# EAGLE design boilerroom (EAGLE 6.6.0)
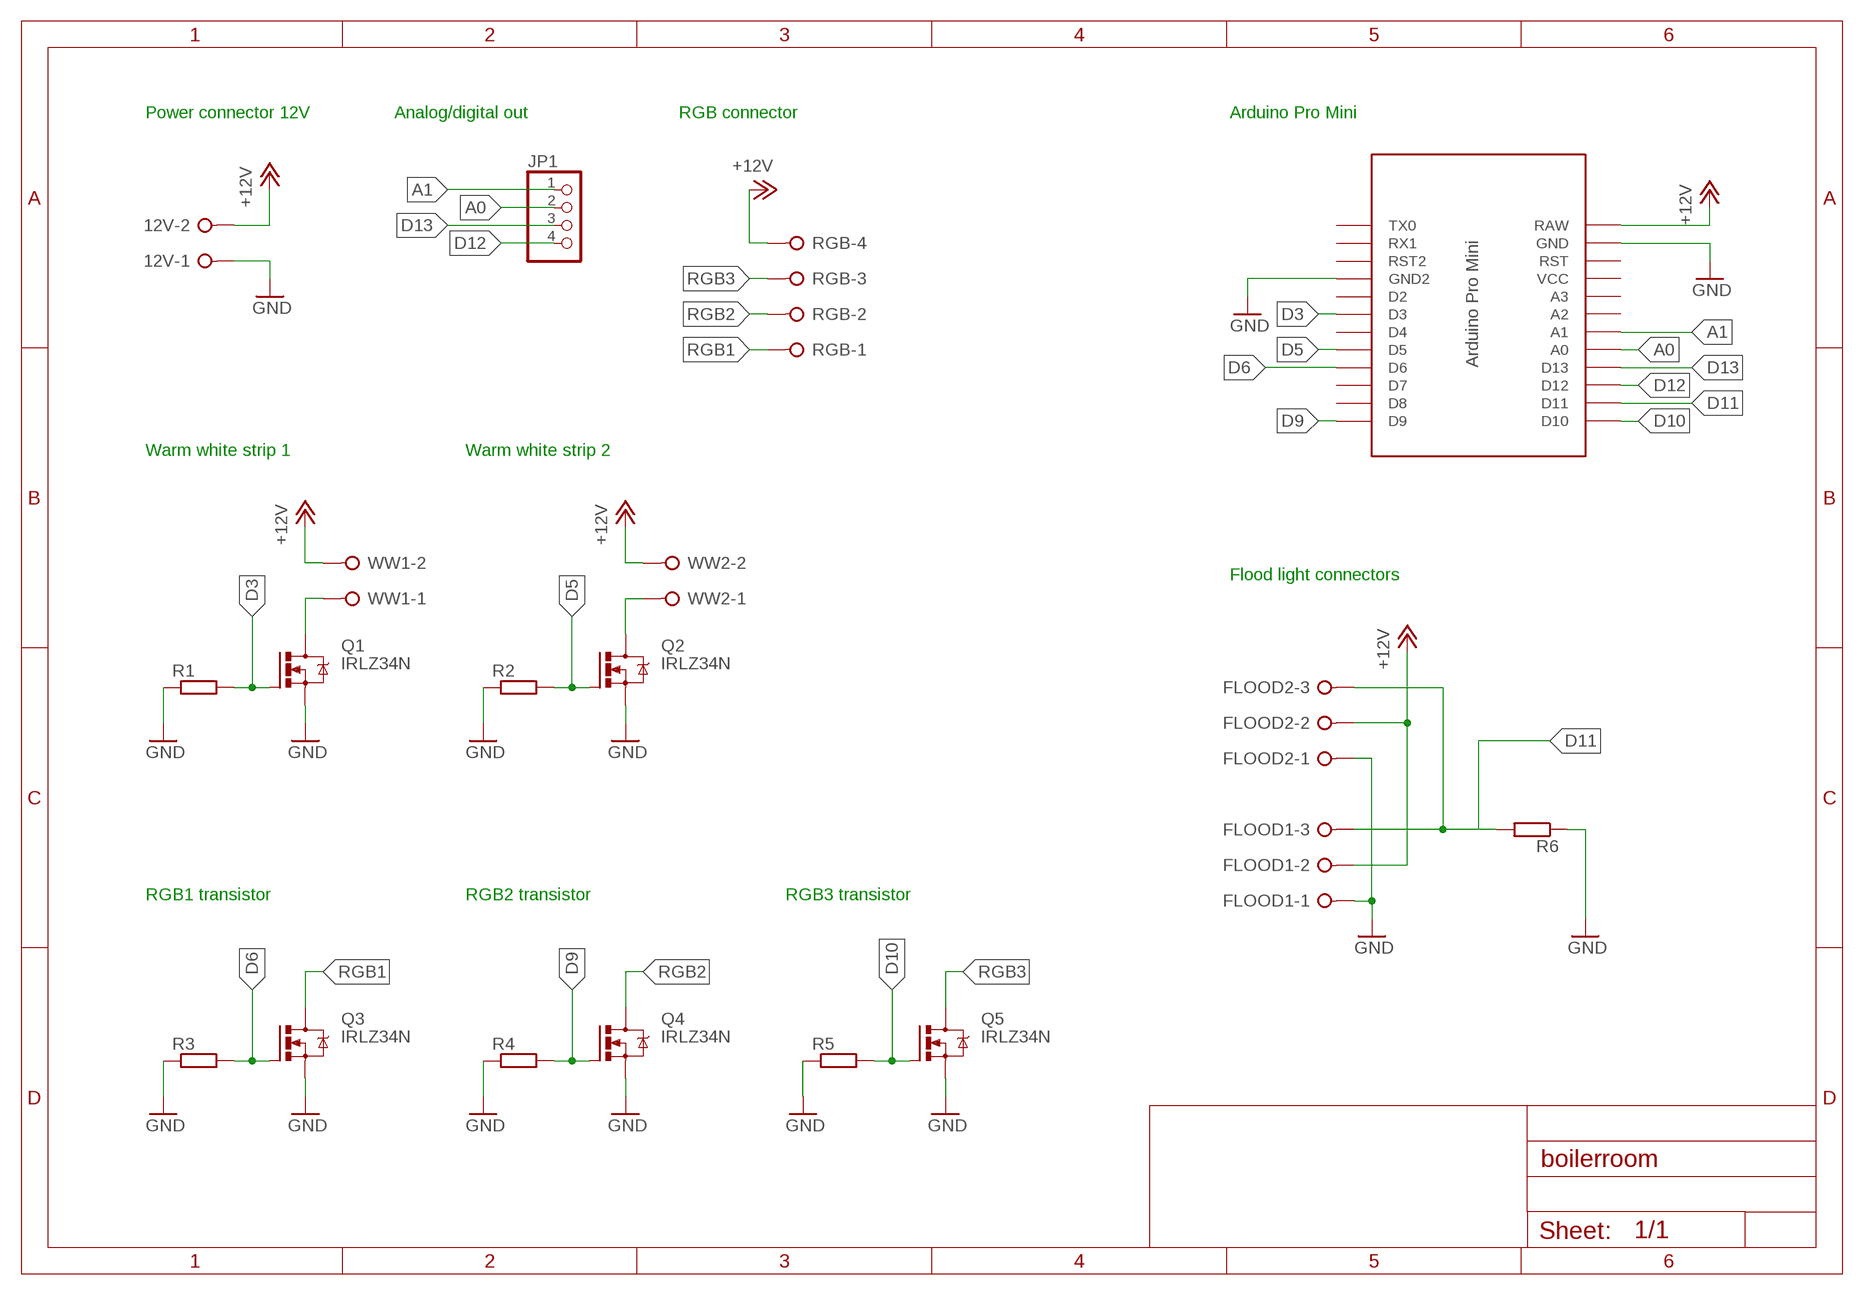
[diagram p0: schematic, sheet 1]

## Parts
12V  W237-02P  [W237-132]
FLOOD1  W237-03P  [W237-133]
FLOOD2  W237-03P  [W237-133]
JP1  PINHD-1X4  [1X04]
Q1  IRLZ34N  IRLZ44ZTO220BV  [TO220BV]
Q2  IRLZ34N  IRLZ44ZTO220BV  [TO220BV]
Q3  IRLZ34N  IRLZ44ZTO220BV  [TO220BV]
Q4  IRLZ34N  IRLZ44ZTO220BV  [TO220BV]
Q5  IRLZ34N  IRLZ44ZTO220BV  [TO220BV]
R1  R-EU_0207/10  [0207/10]
R2  R-EU_0207/10  [0207/10]
R3  R-EU_0207/10  [0207/10]
R4  R-EU_0207/10  [0207/10]
R5  R-EU_0207/10  [0207/10]
R6  R-EU_0207/10  [0207/10]
RGB  W237-04P  [W237-4P]
U$2  PRO-MINI-3V3  [PRO-MINI-3V3]
WW1  W237-02P  [W237-132]
WW2  W237-02P  [W237-132]

## Nets
+12V: 12V.2 FLOOD1.2 FLOOD2.2 RGB.4 U$2.RAW WW1.2 WW2.2
A0: JP1.2 U$2.A0
A1: JP1.1 U$2.A1
D3: Q1.G R1.2 U$2.D3
D5: Q2.G R2.2 U$2.D5
D6: Q3.G R3.2 U$2.D6
D9: Q4.G R4.2 U$2.D9
D10: Q5.G R5.2 U$2.D10
D11: FLOOD1.3 FLOOD2.3 R6.2 U$2.D11
D12: JP1.4 U$2.D12
D13: JP1.3 U$2.D13
GND: 12V.1 FLOOD1.1 FLOOD2.1 Q1.S Q2.S Q3.S Q4.S Q5.S R1.1 R2.1 R3.1 R4.1 R5.1 R6.1 U$2.GND U$2.GND1(GND2)
N$8: Q2.D WW2.1
RGB1: Q3.D RGB.1
RGB2: Q4.D RGB.2
RGB3: Q5.D RGB.3
WW1-: Q1.D WW1.1
Unconnected: U$2.A2 U$2.A3 U$2.D2 U$2.D4 U$2.D7 U$2.D8 U$2.RST U$2.RST1(RST2) U$2.RX1 U$2.TX0 U$2.VCC

## Notes on the sheet
- Power connector 12V | Analog/digital out | RGB connector | Arduino Pro Mini
- Warm white strip 1 | Warm white strip 2
- Flood light connectors
- RGB1 transistor | RGB2 transistor | RGB3 transistor

## Library data of the parts
12V WW1 WW2 = con-wago-508:W237-02P: WAGO SREW CLAMP; OC_FARNELL: unknown; OC_NEWARK: unknown
FLOOD1 FLOOD2 = con-wago-508:W237-03P: WAGO SREW CLAMP; OC_FARNELL: unknown; OC_NEWARK: unknown
JP1 = pinhead:PINHD-1X4: PIN HEADER
Q1-Q5 = transistor-power:IRLZ44Z: N-Channel HEXFET® Power MOSFET Logic Level AUTOMOTIVE MOSFET Source: http://www.irf.com/product-info/datasheets/data/irlz44zpbf.pdf
R1-R6 = rcl:R-EU_: RESISTOR, European symbol
RGB = con-wago-508:W237-04P: WAGO SREW CLAMP; OC_FARNELL: unknown; OC_NEWARK: unknown
U$2 = Arduino-clone:PRO-MINI-3V3

## Board
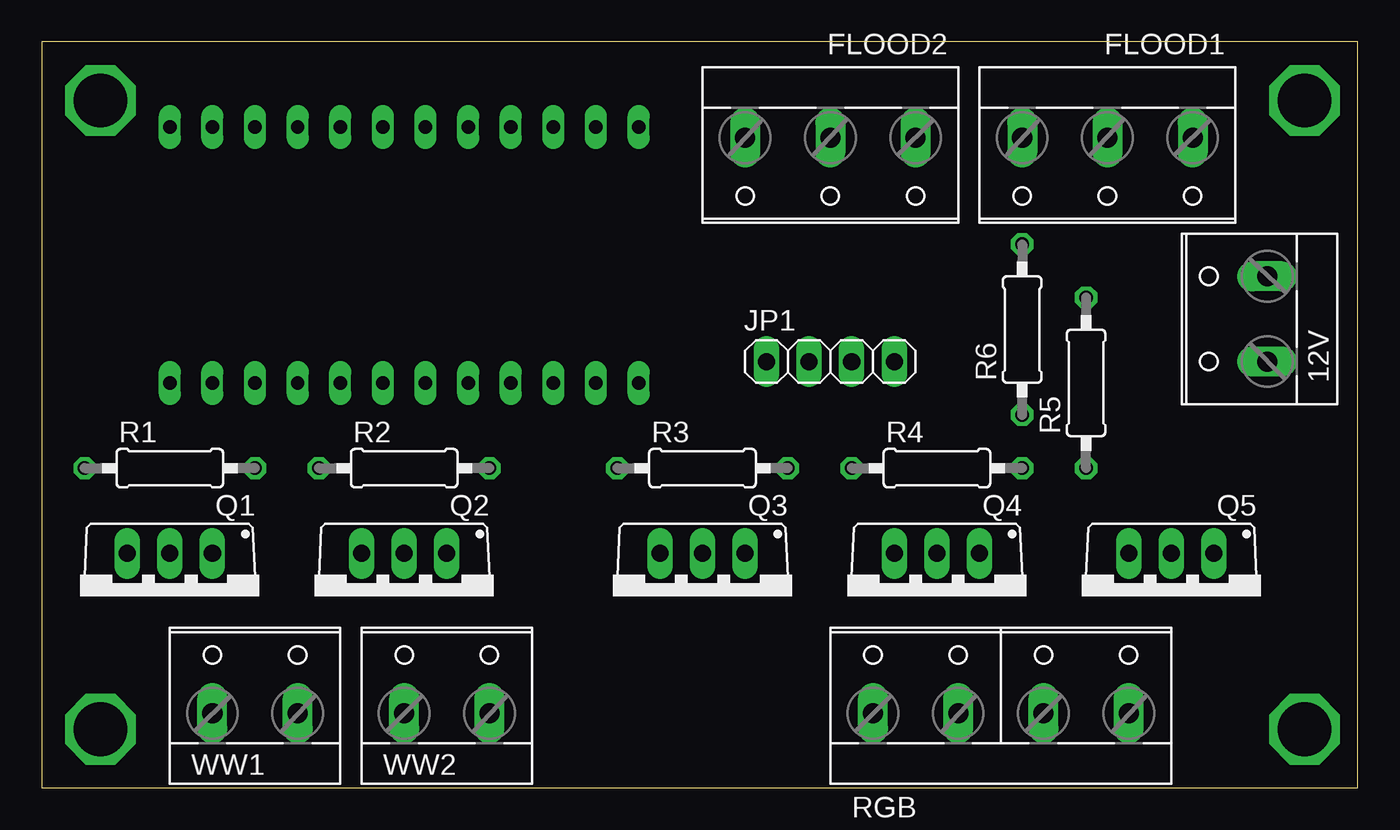
[diagram p1: board, top side]
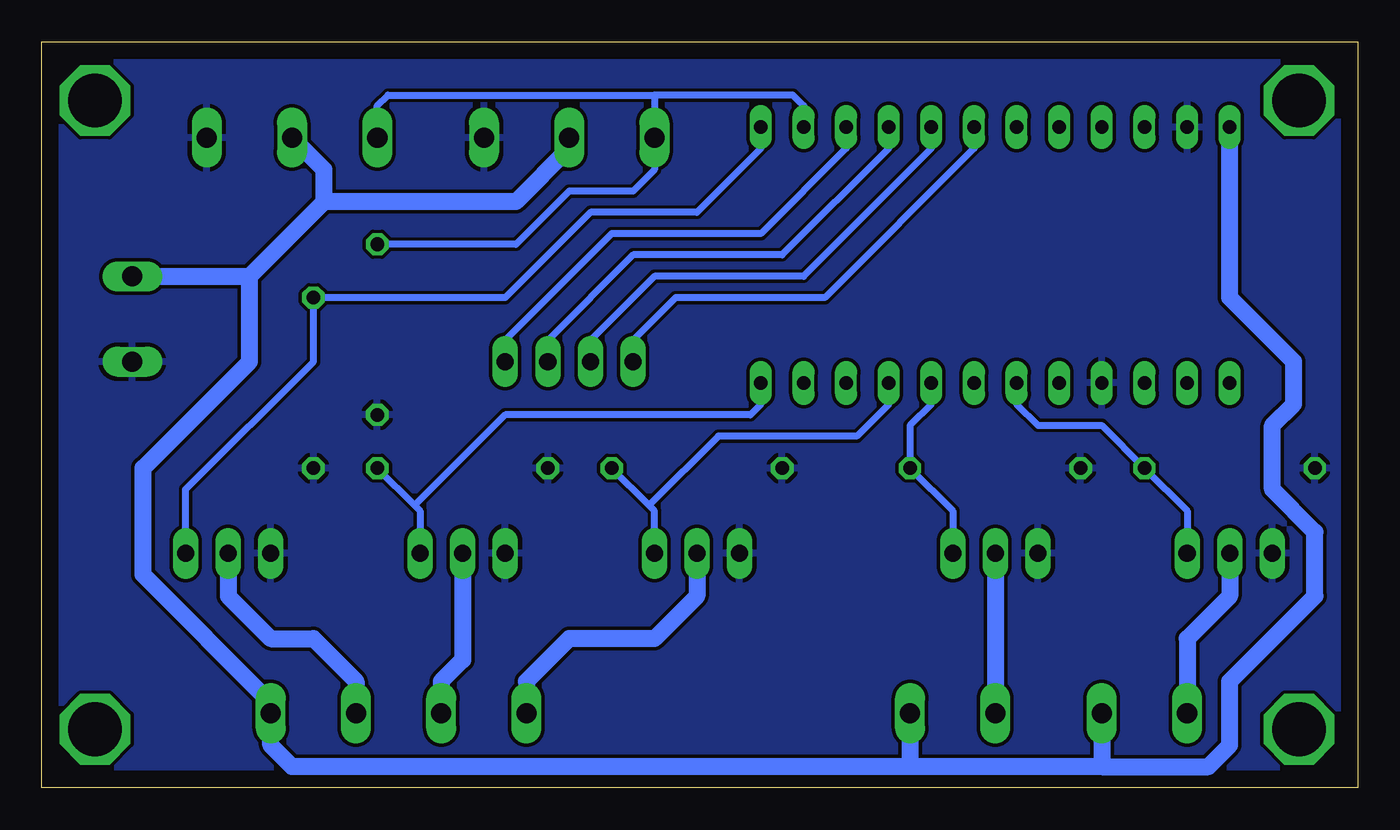
[diagram p2: board, bottom side, seen from below]

Size 78.41 x 44.44 mm. Coordinates in mm from the lower left corner, seen from the top.
Outline: 0,0 78.41,0 78.41,44.44 0,44.44 0,0
Copper layers (1*16): Top 0.035mm / dielectric 1.5mm / Bottom 0.035mm
Design rules "default": minimum track width 10mil, minimum drill 24mil, track to track 8mil, track to pad 8mil, pad to pad 8mil, via to via 8mil, smd to smd 8mil, copper to edge 40mil, drill to drill 8mil, minimum pad ring 10mil, minimum via ring 8mil, stop-mask expansion 4mil, vias tented up to drill 0mil, thermal gap 10mil

### Footprints (pad centres in the part's own frame; a part is rotated, then mirrored left to right if it is on the bottom)
W237-132 = drill 1.194 long: 1 -2.54,-0.635; 2 2.54,-0.635
W237-133 = drill 1.194 long: 1 -5.08,-0.635; 2 0,-0.635; 3 5.08,-0.635
1X04 = drill 1.016 long: 1 -3.81,0; 2 -1.27,0; 3 1.27,0; 4 3.81,0
TO220BV = drill 1.016 long: D 0,-2.54; G -2.54,-2.54; S 2.54,-2.54
0207/10 = drill 0.813 octagon: 1 -5.08,0; 2 5.08,0
W237-4P = drill 1.194 long: 1 -7.62,-0.635; 2 -2.54,-0.635; 3 2.54,-0.635; 4 7.62,-0.635
PRO-MINI-3V3 = drill 0.8 long: A0 7.62,-5.08; A1 7.62,-2.54; A2 7.62,0; A3 7.62,2.54; D2 -7.62,2.54; D3 -7.62,0; D4 -7.62,-2.54; D5 -7.62,-5.08; D6 -7.62,-7.62; D7 -7.62,-10.16; D8 -7.62,-12.7; D9 -7.62,-15.24; D10 7.62,-15.24; D11 7.62,-12.7; D12 7.62,-10.16; D13 7.62,-7.62; GND 7.62,10.16; GND1 -7.62,5.08; RAW 7.62,12.7; RST 7.62,7.62; RST1 -7.62,7.62; RX1 -7.62,10.16; TX0 -7.62,12.7; VCC 7.62,5.08

### Placement (x,y rotation side)
12V  72.39,27.94 90 top
FLOOD1  63.5,38.1 180 top
FLOOD2  46.99,38.1 180 top
JP1  46.99,25.4 0 top
Q1  7.62,11.43 180 top
Q2  21.59,11.43 180 top
Q3  39.37,11.43 180 top
Q4  53.34,11.43 180 top
Q5  67.31,11.43 180 top
R1  7.62,19.05 0 top
R2  21.59,19.05 0 top
R3  39.37,19.05 0 top
R4  53.34,19.05 0 top
R5  62.23,24.13 90 top
R6  58.42,27.3 90 top
RGB  57.15,5.08 0 top
U$2  20.32,31.75 90 top
WW1  12.7,5.08 0 top
WW2  24.13,5.08 0 top

### Tracks (layer width: path | path; a pad name or v marks a point on that pad's centre or on a via)
+12V
  Bottom 1.016: 15.24,1.27 26.67,1.27 | WW2.2 26.67,1.27 | 26.67,1.27 63.5,1.27 64.77,2.54 RGB.4 64.77,5.08 72.39,12.7 72.39,19.05 66.04,25.4 66.04,30.48 | 12V.2 66.04,30.48 | WW1.2 15.24,1.27 | 15.24,1.27 8.89,1.27 7.62,2.54 7.62,6.35 2.54,11.43 2.54,15.24 5.08,17.78 5.08,21.59 3.81,22.86 3.81,25.4 7.62,29.21 U$2.RAW | FLOOD2.2 46.99,38.1 50.16,34.92 61.59,34.92 | 66.04,30.48 61.59,34.92 | 61.59,34.92 61.59,36.83 FLOOD1.2
A0
  Bottom 0.406: U$2.A0 25.4,38.1 33.02,30.48 41.91,30.48 45.72,26.67 JP1.2
A1
  Bottom 0.406: U$2.A1 22.86,38.1 31.75,29.21 40.64,29.21 43.18,26.67 JP1.1
D3
  Bottom 0.406: U$2.D3 20.32,22.86 19.05,21.59 15.24,21.59 R1.2 10.16,16.51 Q1.G
D5
  Bottom 0.406: Q2.G 24.13,16.51 R2.2 26.67,21.59 25.4,22.86 U$2.D5
D6
  Bottom 0.406: Q3.G 41.91,16.51 42.23,16.83 | 42.23,16.83 R3.2 | 42.23,16.83 38.1,20.95 29.84,20.95 27.94,22.86 U$2.D6
D9
  Bottom 0.406: R4.2 56.2,16.83 | 56.2,16.83 55.88,16.51 Q4.G | 56.2,16.83 50.8,22.23 36.2,22.23 35.56,22.86 U$2.D9
D10
  Bottom 0.406: Q5.G 69.85,17.78 62.23,25.4 R5.2 50.8,29.21 45.72,34.29 39.37,34.29 35.56,38.1 U$2.D10
D11
  Bottom 0.406: U$2.D11 33.02,40.64 33.66,41.27 41.91,41.27 | 41.91,41.27 57.78,41.27 58.42,40.64 FLOOD1.3 | R6.2 50.16,32.38 46.99,35.56 43.18,35.56 41.91,36.83 FLOOD2.3 41.91,41.27
D12
  Bottom 0.406: U$2.D12 30.48,38.1 35.56,33.02 44.45,33.02 50.8,26.67 JP1.4
D13
  Bottom 0.406: U$2.D13 27.94,38.1 34.29,31.75 43.18,31.75 48.26,26.67 JP1.3
GND
  pour Bottom: 0,44.45 78.42,44.45 78.42,0 0,0
N$3  (via drill 3.2)
  other vias: 3.49,40.96
N$8
  Bottom 1.016: Q2.D WW2.1
N$9  (via drill 3.2)
  other vias: 75.25,40.96
N$12  (via drill 3.2)
  other vias: 75.25,3.49
N$13  (via drill 3.2)
  other vias: 3.49,3.49
RGB1
  Bottom 1.016: RGB.1 49.53,6.35 46.99,8.89 41.91,8.89 39.37,11.43 Q3.D
RGB2
  Bottom 1.016: RGB.2 54.61,6.35 53.34,7.62 Q4.D
RGB3
  Bottom 1.016: RGB.3 59.69,6.35 62.23,8.89 64.77,8.89 67.31,11.43 Q5.D
WW1-
  Bottom 1.016: Q1.D 7.62,11.43 10.16,8.89 WW1.1